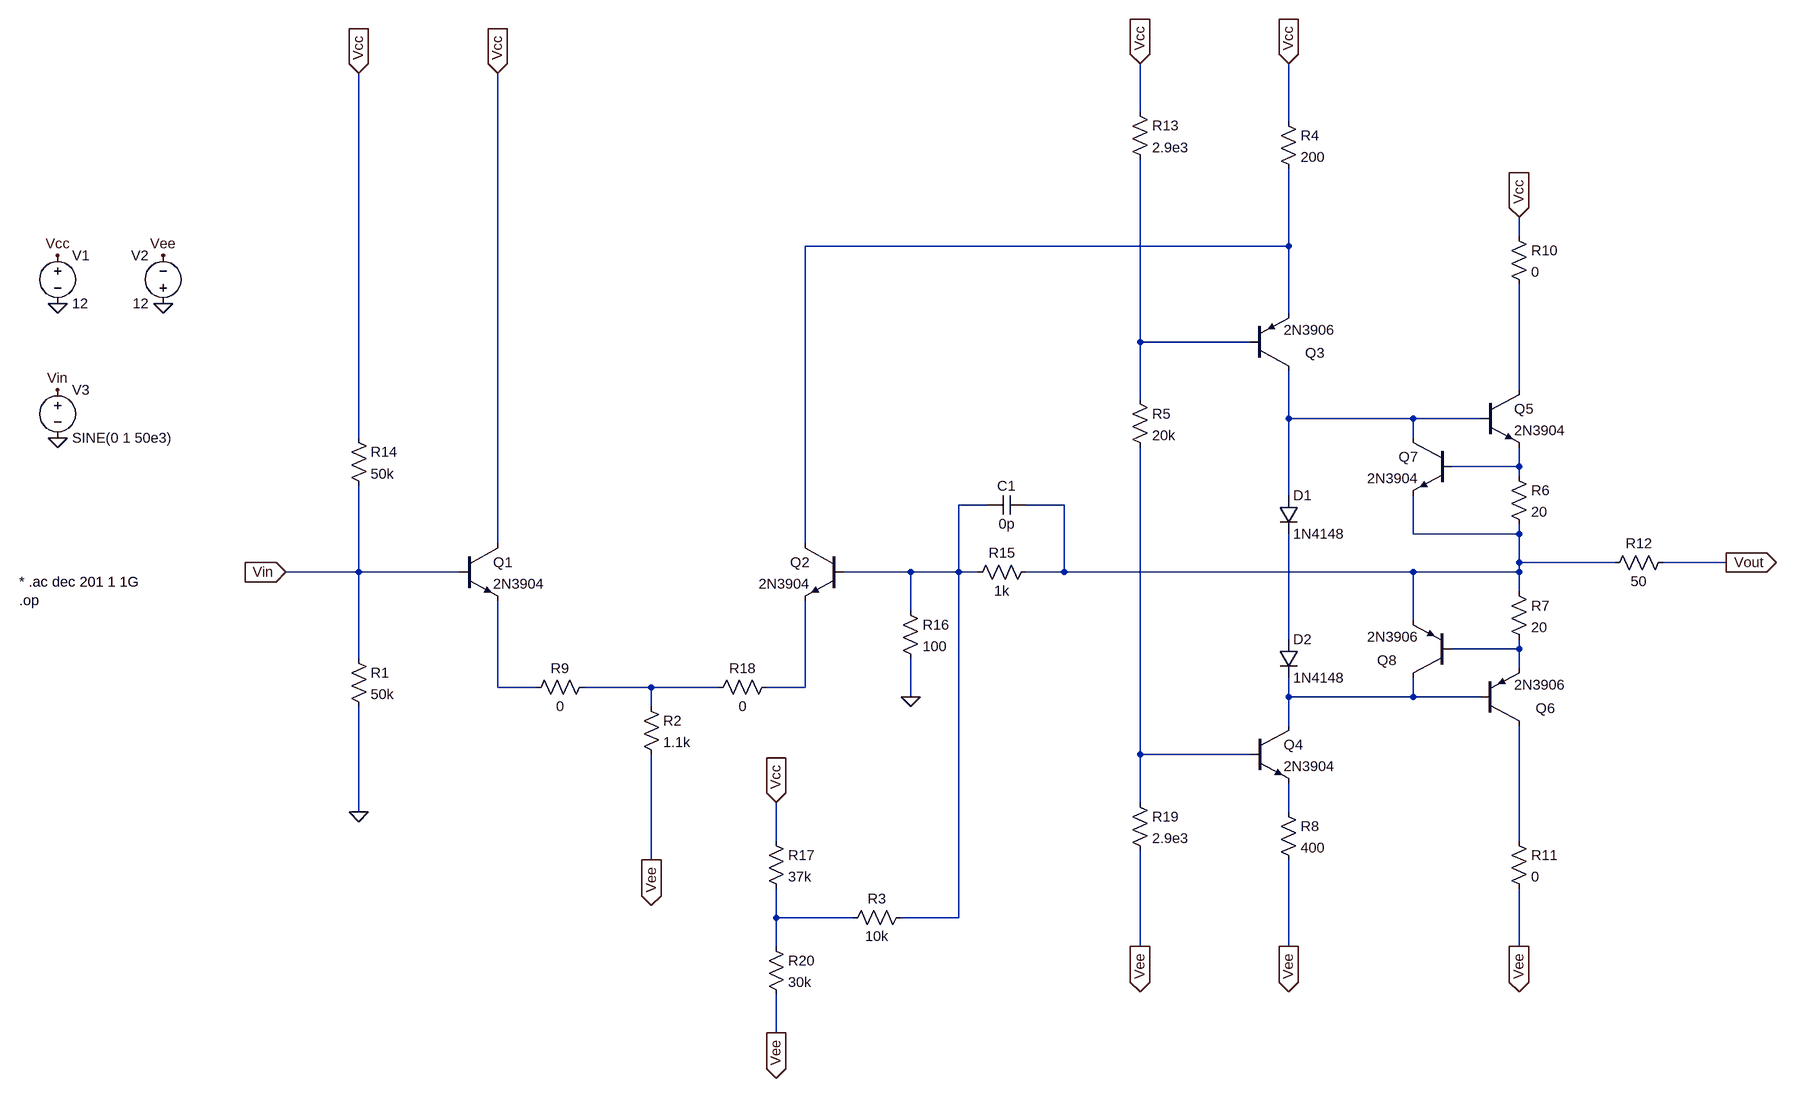
[diagram p0: schematic output_amplifier.asc]
output_amplifier.asc, the LTspice schematic file:
Version 4
SHEET 1 2212 1224
WIRE 928 -400 928 -480
WIRE 1344 -384 1344 -480
WIRE 1728 -192 1728 -224
WIRE 1344 -176 1344 -304
WIRE 1344 -176 368 -176
WIRE 1344 -64 1344 -176
WIRE 928 -16 928 -320
WIRE 1280 -16 928 -16
WIRE 1728 64 1728 -112
WIRE 928 80 928 -16
WIRE 1344 112 1344 32
WIRE 1552 112 1344 112
WIRE 1664 112 1552 112
WIRE -464 144 -464 -464
WIRE 1552 144 1552 112
WIRE 1728 192 1728 160
WIRE 1728 192 1616 192
WIRE 1728 208 1728 192
WIRE 1344 240 1344 112
WIRE 672 256 624 256
WIRE 800 256 736 256
WIRE 1552 304 1552 240
WIRE 1728 304 1728 288
WIRE 1728 304 1552 304
WIRE -144 320 -144 -464
WIRE 368 320 368 -176
WIRE 1728 352 1728 304
WIRE 1888 352 1728 352
WIRE 2112 352 1968 352
WIRE -464 368 -464 224
WIRE -464 368 -624 368
WIRE -208 368 -464 368
WIRE 544 368 432 368
WIRE 624 368 624 256
WIRE 624 368 544 368
WIRE 656 368 624 368
WIRE 800 368 800 256
WIRE 800 368 736 368
WIRE 1552 368 800 368
WIRE 1728 368 1728 352
WIRE 1728 368 1552 368
WIRE 1728 400 1728 368
WIRE 544 432 544 368
WIRE 1552 448 1552 368
WIRE 1344 480 1344 304
WIRE 1728 496 1728 480
WIRE 1728 496 1616 496
WIRE -464 512 -464 368
WIRE 1728 528 1728 496
WIRE -144 560 -144 416
WIRE -80 560 -144 560
WIRE 112 560 0 560
WIRE 224 560 112 560
WIRE 368 560 368 416
WIRE 368 560 304 560
WIRE 544 576 544 512
WIRE 1344 576 1344 544
WIRE 1552 576 1552 544
WIRE 1552 576 1344 576
WIRE 1664 576 1552 576
WIRE 112 592 112 560
WIRE 1344 624 1344 576
WIRE 928 672 928 160
WIRE 1280 672 928 672
WIRE 928 752 928 672
WIRE -464 768 -464 592
WIRE 1344 768 1344 720
WIRE 320 816 320 752
WIRE 1728 816 1728 624
WIRE 112 848 112 672
WIRE 320 944 320 896
WIRE 448 944 320 944
WIRE 624 944 624 368
WIRE 624 944 528 944
WIRE 320 992 320 944
WIRE 928 992 928 832
WIRE 1344 992 1344 848
WIRE 1728 992 1728 896
WIRE 320 1136 320 1072
FLAG -960 -80 0
FLAG -1136 -80 0
FLAG -1136 -160 Vcc
FLAG -960 -160 Vee
FLAG -624 368 Vin
IOPIN -624 368 In
FLAG -1136 144 0
FLAG -1136 64 Vin
FLAG -464 768 0
FLAG 112 848 Vee
IOPIN 112 848 Out
FLAG -144 -464 Vcc
IOPIN -144 -464 In
FLAG 1344 -480 Vcc
IOPIN 1344 -480 In
FLAG 1728 -224 Vcc
IOPIN 1728 -224 In
FLAG 1344 992 Vee
IOPIN 1344 992 Out
FLAG 1728 992 Vee
IOPIN 1728 992 Out
FLAG 928 -480 Vcc
IOPIN 928 -480 In
FLAG 2112 352 Vout
IOPIN 2112 352 Out
FLAG -464 -464 Vcc
IOPIN -464 -464 In
FLAG 928 992 Vee
IOPIN 928 992 Out
FLAG 544 576 0
FLAG 320 1136 Vee
IOPIN 320 1136 Out
FLAG 320 752 Vcc
IOPIN 320 752 In
SYMBOL npn -208 320 R0
SYMATTR InstName Q1
SYMATTR Value 2N3904
SYMBOL npn 432 320 M0
SYMATTR InstName Q2
SYMATTR Value 2N3904
SYMBOL Res -480 496 R0
SYMATTR InstName R1
SYMATTR Value 50k
SYMBOL Res 96 576 R0
SYMATTR InstName R2
SYMATTR Value 1.1k
SYMBOL voltage -1136 -176 R0
SYMATTR InstName V1
SYMATTR Value 12
SYMBOL voltage -960 -64 R180
WINDOW 0 24 96 Left 2
WINDOW 3 24 16 Left 2
SYMATTR InstName V2
SYMATTR Value 12
SYMBOL voltage -1136 48 R0
SYMATTR InstName V3
SYMATTR Value SINE(0 1 50e3)
SYMATTR Value2 AC 1
SYMBOL res 1328 -400 R0
SYMATTR InstName R4
SYMATTR Value 200
SYMBOL res 912 64 R0
SYMATTR InstName R5
SYMATTR Value 20k
SYMBOL pnp 1280 32 M180
WINDOW 0 92 29 Left 2
SYMATTR InstName Q3
SYMATTR Value 2N3906
SYMBOL diode 1328 240 R0
SYMATTR InstName D1
SYMATTR Value 1N4148
SYMBOL diode 1328 480 R0
SYMATTR InstName D2
SYMATTR Value 1N4148
SYMBOL npn 1280 624 R0
SYMATTR InstName Q4
SYMATTR Value 2N3904
SYMBOL npn 1664 64 R0
SYMATTR InstName Q5
SYMATTR Value 2N3904
SYMBOL res 1712 192 R0
SYMATTR InstName R6
SYMATTR Value 20
SYMBOL res 1712 384 R0
SYMATTR InstName R7
SYMATTR Value 20
SYMBOL res 1328 752 R0
SYMATTR InstName R8
SYMATTR Value 400
SYMBOL res 1712 -208 R0
SYMATTR InstName R10
SYMATTR Value 0
SYMBOL res 1712 800 R0
SYMATTR InstName R11
SYMATTR Value 0
SYMBOL res 1984 336 R90
WINDOW 0 0 56 VBottom 2
WINDOW 3 32 56 VTop 2
SYMATTR InstName R12
SYMATTR Value 50
SYMBOL pnp 1664 624 M180
WINDOW 0 92 29 Left 2
SYMATTR InstName Q6
SYMATTR Value 2N3906
SYMBOL res 912 -416 R0
SYMATTR InstName R13
SYMATTR Value 2.9e3
SYMBOL Res -480 128 R0
SYMATTR InstName R14
SYMATTR Value 50k
SYMBOL res 640 384 R270
WINDOW 0 32 56 VTop 2
WINDOW 3 0 56 VBottom 2
SYMATTR InstName R15
SYMATTR Value 1k
SYMBOL res 528 416 R0
SYMATTR InstName R16
SYMATTR Value 100
SYMBOL res 912 736 R0
SYMATTR InstName R19
SYMATTR Value 2.9e3
SYMBOL res 304 800 R0
SYMATTR InstName R17
SYMATTR Value 37k
SYMBOL res 304 976 R0
SYMATTR InstName R20
SYMATTR Value 30k
SYMBOL Res 544 928 R90
WINDOW 0 0 56 VBottom 2
WINDOW 3 32 56 VTop 2
SYMATTR InstName R3
SYMATTR Value 10k
SYMBOL Res 16 544 R90
WINDOW 0 0 56 VBottom 2
WINDOW 3 32 56 VTop 2
SYMATTR InstName R9
SYMATTR Value 0
SYMBOL Res 320 544 R90
WINDOW 0 0 56 VBottom 2
WINDOW 3 32 56 VTop 2
SYMATTR InstName R18
SYMATTR Value 0
SYMBOL Cap 736 240 R90
WINDOW 0 0 32 VBottom 2
WINDOW 3 32 32 VTop 2
SYMATTR InstName C1
SYMATTR Value 0p
SYMBOL npn 1616 144 M0
SYMATTR InstName Q7
SYMATTR Value 2N3904
SYMBOL pnp 1616 544 R180
WINDOW 0 92 29 Left 2
SYMATTR InstName Q8
SYMATTR Value 2N3906
TEXT -1200 384 Left 2 !* .ac dec 201 1 1G\n.op

The netlist it stands for:
* output_amplifier.asc
Q1 Vcc Vin N010 0 2N3904
Q2 N001 N006 N012 0 2N3904
R1 Vin 0 50k
R2 N011 Vee 1.1k
V1 Vcc 0 12
V2 0 Vee 12
V3 Vin 0 SINE(0 1 50e3) AC 1
R4 Vcc N001 200
R5 N002 N014 20k
Q3 N004 N002 N001 0 2N3906
D1 N004 N008 1N4148
D2 N008 N013 1N4148
Q4 N013 N014 N015 0 2N3904
Q5 N003 N004 N005 0 2N3904
R6 N005 N007 20
R7 N007 N009 20
R8 N015 Vee 400
R10 Vcc N003 0
R11 N016 Vee 0
R12 Vout N007 50
Q6 N016 N013 N009 0 2N3906
R13 Vcc N002 2.9e3
R14 Vcc Vin 50k
R15 N006 N007 1k
R16 N006 0 100
R19 N014 Vee 2.9e3
R17 Vcc N017 37k
R20 N017 Vee 30k
R3 N006 N017 10k
R9 N011 N010 0
R18 N012 N011 0
C1 N007 N006 0p
Q7 N004 N005 N007 0 2N3904
Q8 N013 N009 N007 0 2N3906
.model D D
.lib standard.dio
.model NPN NPN
.model PNP PNP
.lib standard.bjt
* .ac dec 201 1 1G
.op
.backanno
.end